# Altium schematic sheet Page11 BOOT_CFG.SchDoc
size 513 x 386 mm
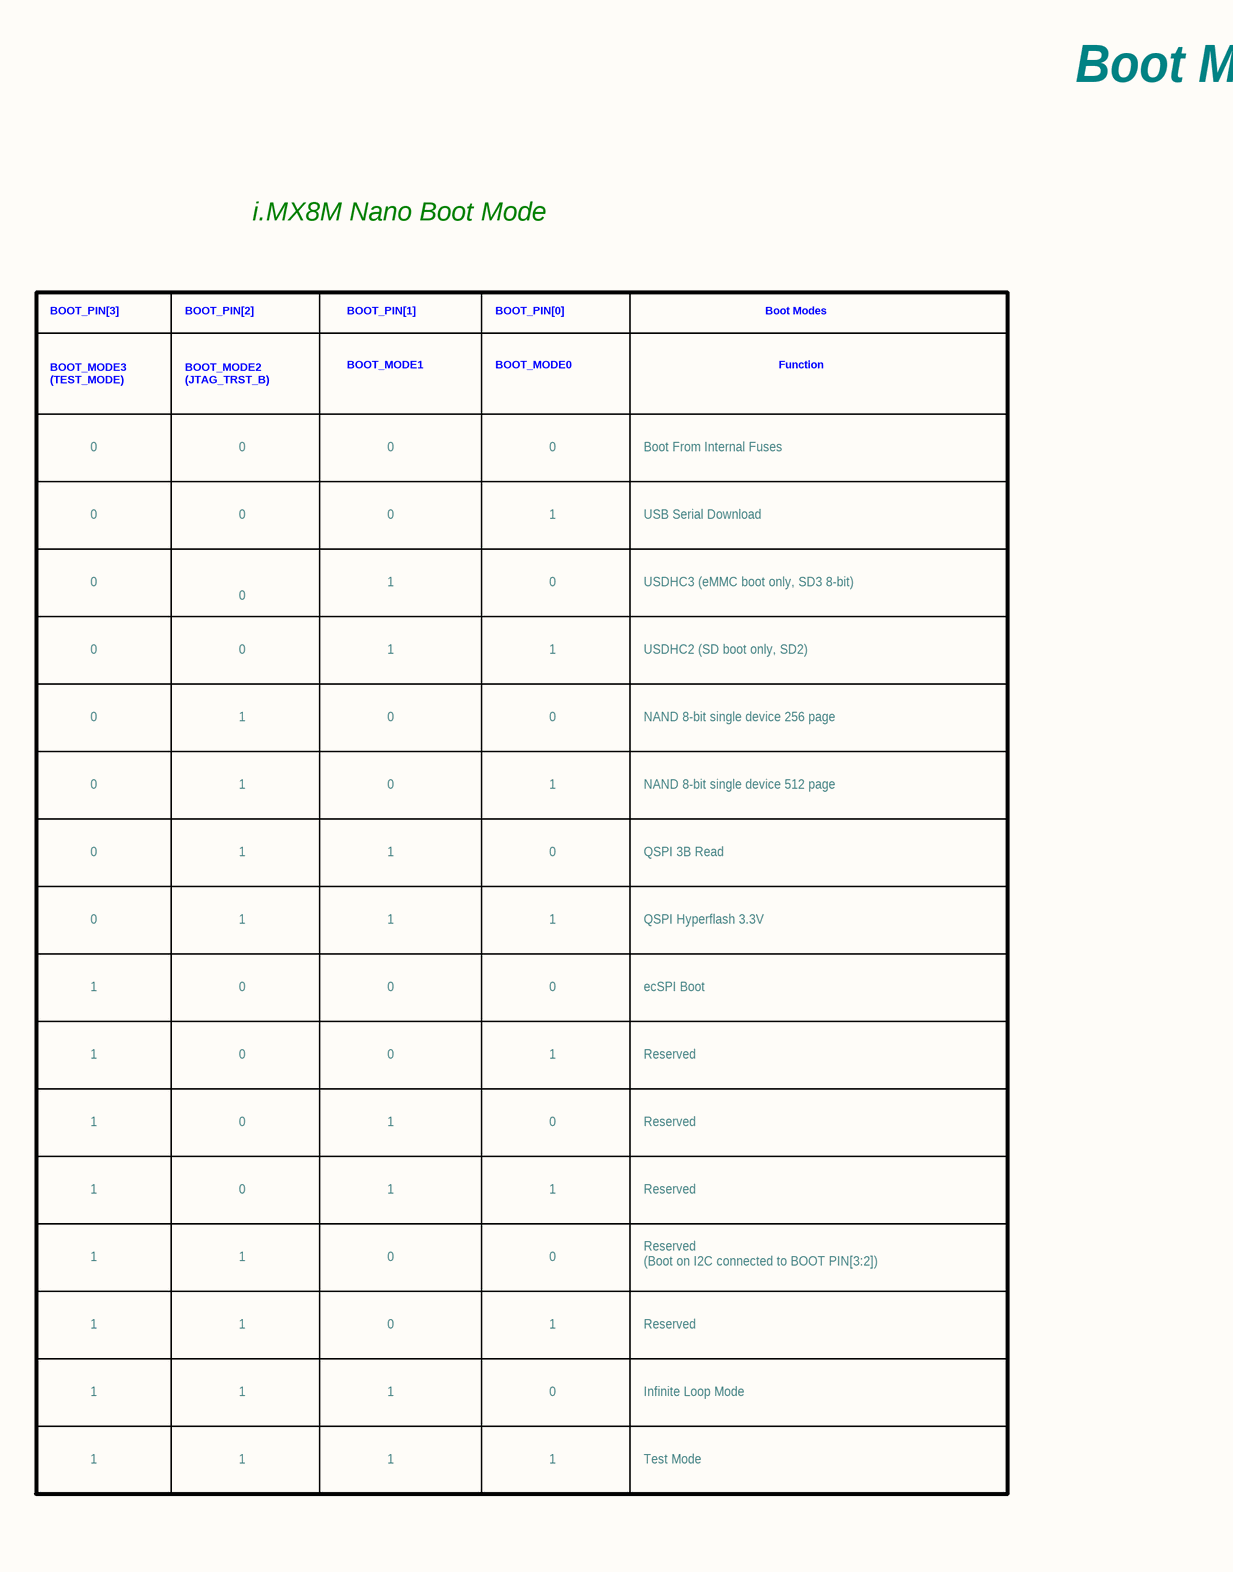
[diagram p0: Page11 BOOT_CFG.SchDoc, left]
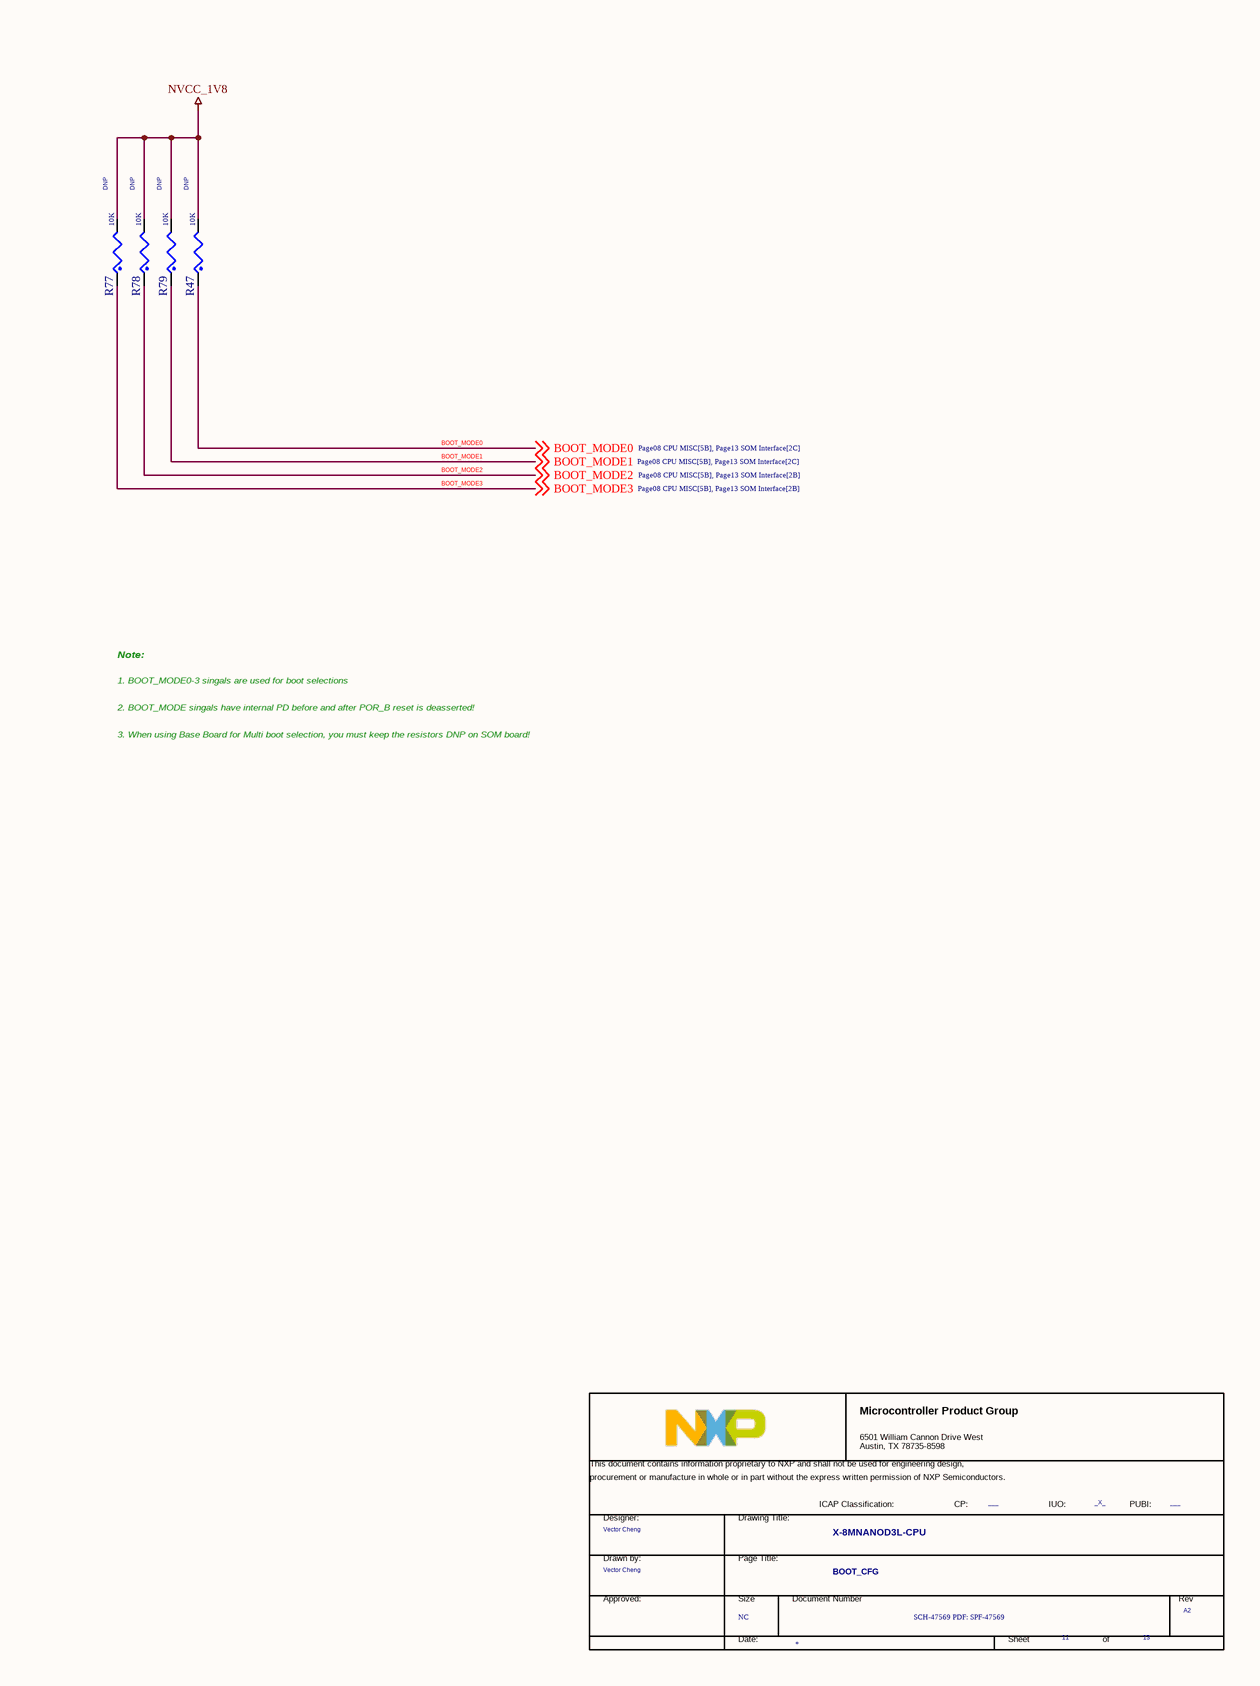
[diagram p1: Page11 BOOT_CFG.SchDoc, right]

## Parts
*  FCP: ___  FIUO: _X_  DrawnBy: Vector Cheng  PageTitle: BOOT_CFG  Page Count: 13  Page Number: 11  Page Size: NC  Title: X-8MNANOD3L-CPU  RevCode: A2  Doc: SCH-47569 PDF: SPF-47569  (hidden comment: TitleBlock_MCPG)  (graphical)
R47  10K  ASSY_OPT: DNP  [0402_CC_RES]
R77  10K  ASSY_OPT: DNP  [0402_CC_RES]
R78  10K  ASSY_OPT: DNP  [0402_CC_RES]
R79  10K  ASSY_OPT: DNP  [0402_CC_RES]

## Nets
NVCC_1V8: R47.2 R77.2 R78.2 R79.2
BOOT_MODE0: R47.1 ; off-sheet BOOT_MODE0
BOOT_MODE1: R79.1 ; off-sheet BOOT_MODE1
BOOT_MODE2: R78.1 ; off-sheet BOOT_MODE2
BOOT_MODE3: R77.1 ; off-sheet BOOT_MODE3

## Notes on the sheet
- Boot Mode
- i.MX8M Nano Boot Mode
- BOOT_PIN[3]
- BOOT_PIN[2]
- BOOT_PIN[1]
- BOOT_PIN[0]
- Boot Modes
- BOOT_MODE1
- BOOT_MODE0
- Function
- BOOT_MODE3
  (TEST_MODE)
- 0
- BOOT_MODE2
  (JTAG_TRST_B)
- Boot From Internal Fuses
- 1
- USB Serial Download
- USDHC3 (eMMC boot only, SD3 8-bit)
- USDHC2 (SD boot only, SD2)
- NAND 8-bit single device 256 page
- NAND 8-bit single device 512 page
- QSPI 3B Read
- QSPI Hyperflash 3.3V
- ecSPI Boot
- Reserved
- Note:
- 3. When using Base Board for Multi boot selection, you must keep the resistors DNP on SOM board!
- 2. BOOT_MODE singals have internal PD before and after POR_B reset is deasserted!
- 1. BOOT_MODE0-3 singals are used for boot selections
- Reserved
  (Boot on I2C connected to BOOT PIN[3:2])
- Infinite Loop Mode
- Test Mode
- (in symbol TitleBlock_MCPG) Microcontroller Product Group; 6501 William Cannon Drive West / Austin, TX 78735-8598; This document contains information proprietary to NXP and shall not be used for engineering design,; procurement or manufacture in whole or in part without the express written permission of NXP Semiconductors.; ICAP Classification:; CP:; IUO:; PUBI:; Designer:; Drawing Title:; Drawn by:; Page Title:; Approved:; Size; Document Number; Rev; Date:; Sheet; of

## Library data of the parts
* = TitleBlock_MCPG: OrgAddr1: NO. 192 Liangjing Rd. Pudong New Area, ShangHai; OrgName: NXP Semiconductor; PUBI: ___; Designer: Vector Cheng; Page Create Date: March  8, 1995; Page Modify Date: *
R47 R77 = RES: RES MF 10K 1/16W 5% 0402; CLASS: DISCRETE; PCB Footprint: 0402_CC; AGILE_PN: 470-75557; MFG_NAME01: VISHAY INTERTECHNOLOGY; MFG_PN01: CRCW040210K0JNED; CAD_APPROVED: Yes; FPLIST: RC0402_25,RC0402_HD,0402_CC; HEIGHT: 0.4 MM; TOL: 5%; Tolerance: 5%; ROHS: Yes
R78 R79 = RES: RES MF 10K 1/16W 5% 0402; CLASS: DISCRETE; PCB Footprint: 0402_CC; FPLIST: RC0402_25,RC0402_HD,0402_CC; CAD_APPROVED: Yes; MFG_PN01: CRCW040210K0JNED; MFG_NAME01: VISHAY INTERTECHNOLOGY; AGILE_PN: 470-75557; ROHS: Yes; Tolerance: 5%; TOL: 5%; HEIGHT: 0.4 MM